# Altium schematic sheet _Geeky_ Sheet1 copy_2023-02-18.schdoc
size 516 x 310 mm; SheetNumber: 1; SheetTotal: 1
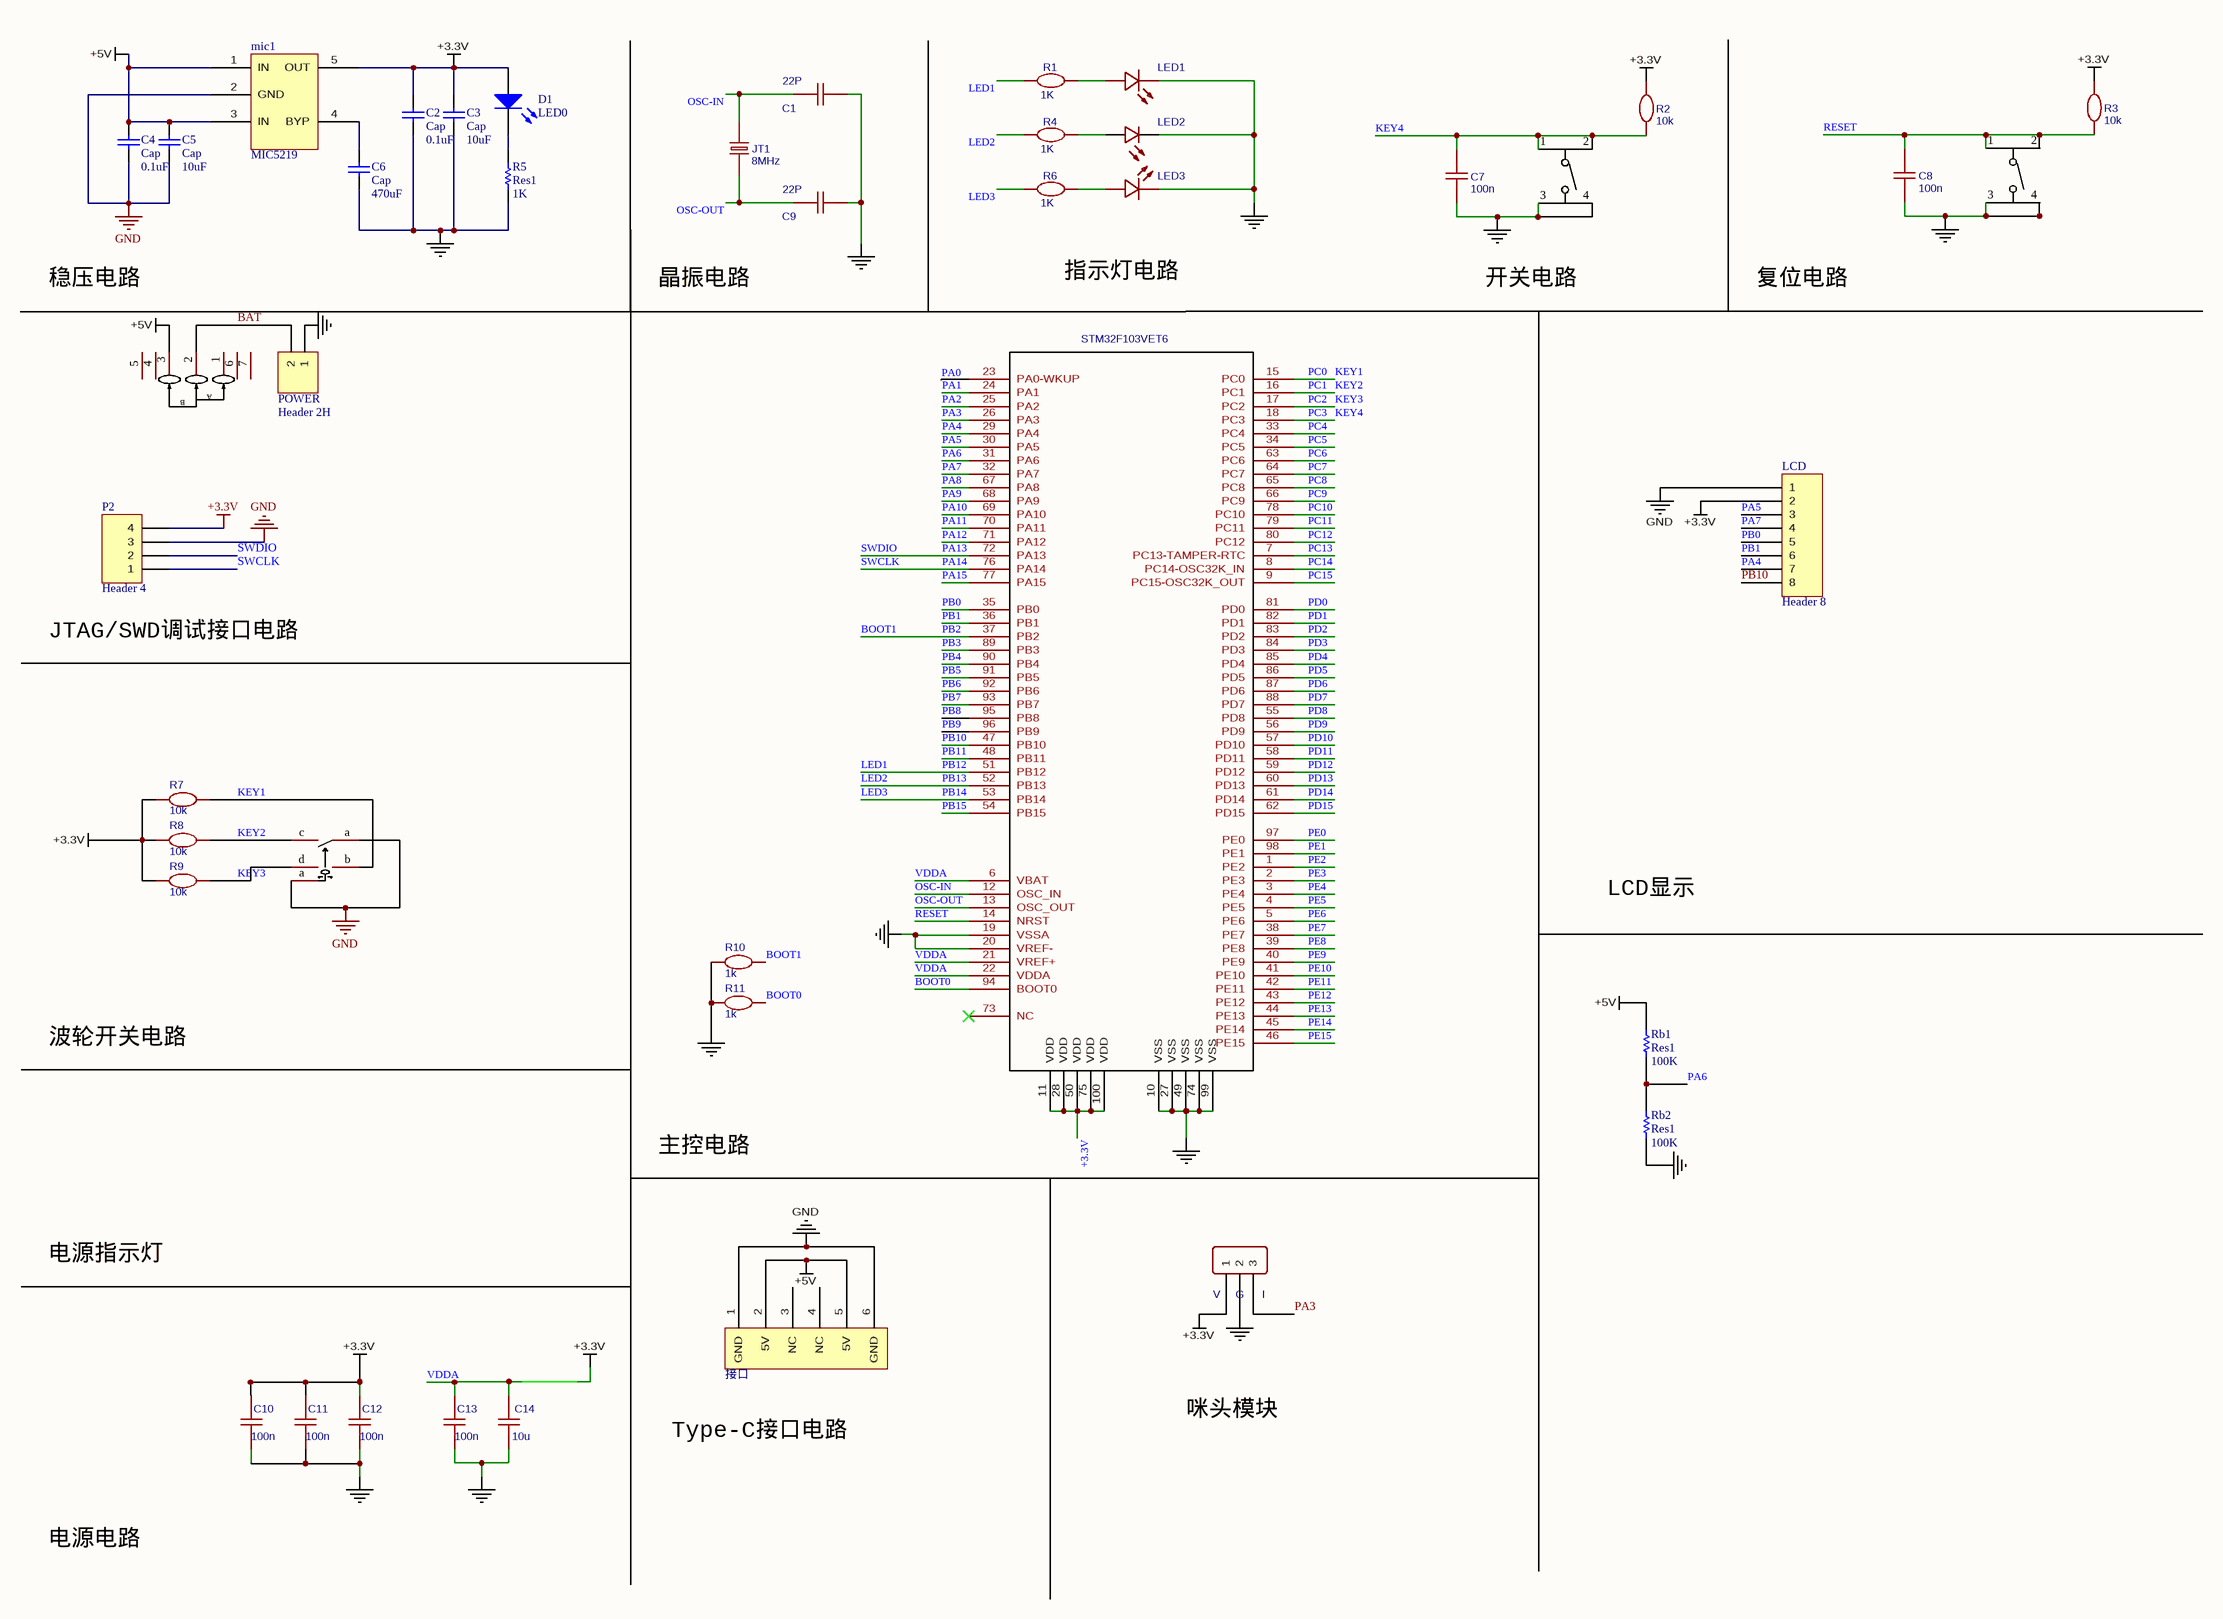
[diagram p0: _Geeky_ Sheet1 copy_2023-02-18.schdoc]

## Parts
?  接口  [typr-c]
C1  22P  [0603]
C2  Cap  value 0.1uF  [0603]
C3  Cap  value 10uF  [0603]
C4  Cap  value 0.1uF  [0603]
C5  Cap  value 10uF  [0603]
C6  Cap  value 470uF  [0603]
C7  100n  [0603]
C8  100n  [0603]
C9  22P  [0603]
C10  100n  [0603]
C11  100n  [0603]
C12  100n  [0603]
C13  100n  [0603]
C14  10u  [0603]
D1  LED0  [led_2]
JT1  8MHz  [OSC-SMD_L5.0-W3.2]
LCD  Header 8  [HDR1X8]
LED1  17-21SUYC/TR8  [led]  (value not drawn)
LED2  17-21/BHC-XL2M2TY/3T  [led]  (value not drawn)
LED3  D-W080508W1-KS2  [led_2]  (value not drawn)
mic1  MIC5219  [mic5219]
P2  Header 4  [HDR1X4]
POWER  Header 2H  [HDR1X2]
R1  1K  [0603]
R2  10k  [0603]
R3  10k  [0603]
R4  1K  [0603]
R5  Res1  value 1K  [0603]
R6  1K  [0603]
R7  10k  [0603]
R8  10k  [0603]
R9  10k  [0603]
R10  1k  [0603]
R11  1k  [0603]
Rb1  Res1  value 100K  [0603]
Rb2  Res1  value 100K  [0603]
SW1  ST-1186BE  [SW-SMD_ST-1186BE]  (value not drawn)
SW2  ST-1186BE  [SW-SMD_ST-1186BE]  (value not drawn)
SW3  TM-2022-3  [旋钮]  (value not drawn)
SW_power  MK-12C02-G025  [sw22]  (value not drawn)
U1  STM32F103VET6  [LQFP-100_L14.0-W14.0-P0.50-LS16.0-BL]
V_G_I  HDR-F-2.54_1x3  [HDR1X3]  (value not drawn)

## Nets
+3.3V: C2.2 C3.2 C10.2 C11.2 C12.2 C13.2 C14.2 D1.1(A) LCD.2 mic1.5(OUT) P2.4 R2.2 R3.2 R7.2 R8.2 R9.2 U1.6(VBAT) U1.11(VDD) U1.21(VREF+) U1.22(VDDA) U1.28(VDD) U1.50(VDD) U1.75(VDD) U1.100(VDD) V_G_I.1  [also labelled VDDA]
+5V: ?.2(5V) ?.5(5V) C4.2 C5.2 mic1.1(IN) mic1.3(IN) Rb1.2 SW_power.3
GND: ?.1(GND) ?.6(GND) C1.1 C2.1 C3.1 C4.1 C5.1 C6.1 C7.2 C8.2 C9.1 C10.1 C11.1 C12.1 C13.1 C14.1 LCD.1 LED1.1(-) LED2.1(-) LED3.2(K) mic1.2(GND) P2.3 POWER.1 R5.1 R10.1 R11.2 Rb2.1 SW1.3 SW1.4 SW2.3 SW2.4 SW3.a U1.10(VSS) U1.19(VSSA) U1.20(VREF-) U1.27(VSS) U1.49(VSS) U1.74(VSS) U1.99(VSS) V_G_I.2
BAT: POWER.2 SW_power.2
BOOT0: R11.1 U1.94(BOOT0)
BOOT1: R10.2 U1.37(PB2)  [also labelled PB2]
KEY1: R7.1 SW3.b U1.15(PC0)  [also labelled PC0]
KEY2: R8.1 SW3.c U1.16(PC1)  [also labelled PC1]
KEY3: R9.1 SW3.d U1.17(PC2)  [also labelled PC2]
KEY4: C7.1 R2.1 SW1.1 SW1.2 U1.18(PC3)  [also labelled PC3]
LED1: R1.1 U1.51(PB12)  [also labelled PB12]
LED2: R4.1 U1.52(PB13)  [also labelled PB13]
LED3: R6.1 U1.53(PB14)  [also labelled PB14]
OSC-IN: C1.2 JT1.2 U1.12(OSC_IN)
OSC-OUT: C9.2 JT1.1 U1.13(OSC_OUT)
PA0: U1.23(PA0-WKUP)
PA1: U1.24(PA1)
PA2: U1.25(PA2)
PA3: U1.26(PA3) V_G_I.3
PA4: LCD.7 U1.29(PA4)
PA5: LCD.3 U1.30(PA5)
PA6: Rb1.1 Rb2.2 U1.31(PA6)
PA7: LCD.4 U1.32(PA7)
PA8: U1.67(PA8)
PA9: U1.68(PA9)
PA10: U1.69(PA10)
PA11: U1.70(PA11)
PA12: U1.71(PA12)
PA13: P2.2 U1.72(PA13)  [also labelled SWDIO]
PA14: P2.1 U1.76(PA14)  [also labelled SWCLK]
PA15: U1.77(PA15)
PB0: LCD.5 U1.35(PB0)
PB1: LCD.6 U1.36(PB1)
PB3: U1.89(PB3)
PB4: U1.90(PB4)
PB5: U1.91(PB5)
PB6: U1.92(PB6)
PB7: U1.93(PB7)
PB8: U1.95(PB8)
PB9: U1.96(PB9)
PB10: LCD.8 U1.47(PB10)
PB11: U1.48(PB11)
PB15: U1.54(PB15)
PC4: U1.33(PC4)
PC5: U1.34(PC5)
PC6: U1.63(PC6)
PC7: U1.64(PC7)
PC8: U1.65(PC8)
PC9: U1.66(PC9)
PC10: U1.78(PC10)
PC11: U1.79(PC11)
PC12: U1.80(PC12)
PC13: U1.7(PC13-TAMPER-RTC)
PC14: U1.8(PC14-OSC32K_IN)
PC15: U1.9(PC15-OSC32K_OUT)
PD0: U1.81(PD0)
PD1: U1.82(PD1)
PD2: U1.83(PD2)
PD3: U1.84(PD3)
PD4: U1.85(PD4)
PD5: U1.86(PD5)
PD6: U1.87(PD6)
PD7: U1.88(PD7)
PD8: U1.55(PD8)
PD9: U1.56(PD9)
PD10: U1.57(PD10)
PD11: U1.58(PD11)
PD12: U1.59(PD12)
PD13: U1.60(PD13)
PD14: U1.61(PD14)
PD15: U1.62(PD15)
PE0: U1.97(PE0)
PE1: U1.98(PE1)
PE2: U1.1(PE2)
PE3: U1.2(PE3)
PE4: U1.3(PE4)
PE5: U1.4(PE5)
PE6: U1.5(PE6)
PE7: U1.38(PE7)
PE8: U1.39(PE8)
PE9: U1.40(PE9)
PE10: U1.41(PE10)
PE11: U1.42(PE11)
PE12: U1.43(PE12)
PE13: U1.44(PE13)
PE14: U1.45(PE14)
PE15: U1.46(PE15)
RESET: C8.1 R3.1 SW2.1 SW2.2 U1.14(NRST)
NetC6_2: C6.2 mic1.4(BYP)
NetD1_2: D1.2(K) R5.2
NetLED1_2: LED1.2(+) R1.2
NetLED2_2: LED2.2(+) R4.2
NetLED3_1: LED3.1(A) R6.2

Not connected (* = marked no-connect by the designer): ? 3(NC) 4(NC); SW_power 1 4 5 6 7; U1 73(NC)*

## Notes on the sheet
- 稳压电路
- 晶振电路
- 指示灯电路
- 开关电路
- 复位电路
- (near P2) JTAG/SWD调试接口电路
- LCD显示
- 波轮开关电路
- 主控电路
- 电源指示灯
- Type-C接口电路
- 咪头模块
- 电源电路
- (in symbol MK-12C02-G025) A; B

## Library data of the parts
? = type-c: TYPE_C
C1 C9 = 20P: nameAlias: Value(F); spicePre: C; spiceSymbolName: Cap_0805_US
C2-C6 = Cap: Capacitor; Published: 8-Jun-2000; LatestRevisionDate: 17-Jul-2002; LatestRevisionNote: Re-released for DXP Platform.; PackageReference: RAD-0.3; Publisher: Altium Limited; PackageDescription: Radial Cap, Thru-Hole; 2 Leads; 0.3 in Pin Spacing
C7 C8 C10-C13 = 100n: nameAlias: Value(F); spicePre: C; spiceSymbolName: Cap_0805_US
C14 = 22u: nameAlias: Value(F); spicePre: C; spiceSymbolName: Cap_0805_US
D1 = LED0: Typical INFRARED GaAs LED; Published: 8-Jun-2000; LatestRevisionDate: 08-Jul-2005; LatestRevisionNote: Mech Layer 1 removed.; PackageReference: LED-0; Publisher: Altium Limited; PackageDescription: LED; 2 Leads
JT1 = 8MHz: BOM_Manufacturer: TAITIEN Elec; BOM_Manufacturer Part: XIHCELNANF-48MHZ; nameAlias: Frequency; Contributor: LCSC; BOM_Supplier: LCSC; BOM_Supplier Part: C295085; spicePre: X; spiceSymbolName: XIHCELNANF-48MHZ
LCD = Header 8: Header, 8-Pin; LatestRevisionDate: 17-Jul-2002; LatestRevisionNote: Re-released for DXP Platform.; Publisher: Altium Limited
LED1 = 17-21SUYC/TR8: BOM_Manufacturer: KENTO; SMT Type: Basic; BOM_Supplier: LCSC; BOM_Manufacturer Part: 17-21SUYC/TR8; BOM_LCSC Assembly: Yes; image: //image.lceda.cn/szlcsc/C2296.jpg; BOM_Supplier Part: C2296; spicePre: L; spiceSymbolName: 17-21SUYC/TR8
LED2 = 17-21/BHC-XL2M2TY/3T: BOM_Manufacturer: EVERLIGHT; SMT Type: Extend; BOM_Supplier: LCSC; BOM_Manufacturer Part: 17-21/BHC-XL2M2TY/3T; image: //image.lceda.cn/szlcsc/C72035.jpg; BOM_Supplier Part: C72035; BOM_LCSC Assembly: Yes; spicePre: L; spiceSymbolName: 17-21/BHC-XL2M2TY/3T
LED3 = D-W080508W1-KS2: BOM_Manufacturer: ARKLED; Contributor: LCSC; BOM_Supplier: LCSC; BOM_Manufacturer Part: D-W080508W1-KS2; BOM_Supplier Part: C130115; spicePre: L; spiceSymbolName: D-W080508W1-KS2
P2 = Header 4: Header, 4-Pin; LatestRevisionDate: 17-Jul-2002; LatestRevisionNote: Re-released for DXP Platform.; Publisher: Altium Limited
POWER = Header 2H: Header, 2-Pin, Right Angle; LatestRevisionDate: 17-Jul-2002; LatestRevisionNote: Re-released for DXP Platform.; Publisher: Altium Limited
R1 R4 R6 = 330: nameAlias: Value(Ω); spicePre: R; spiceSymbolName: Res_0805(1/8W)_EU
R2 R3 R7-R11 = 10k: nameAlias: Value(Ω); spicePre: R; spiceSymbolName: Res_0805(1/8W)_EU
R5 Rb1 Rb2 = Res1: Resistor; Published: 8-Jun-2000; LatestRevisionDate: 17-Jul-2002; LatestRevisionNote: Re-released for DXP Platform.; PackageReference: AXIAL-0.3; Publisher: Altium Limited; PackageDescription: Axial Device, Thru-Hole; 2 Leads; 0.3 in Pin Spacing
SW1 SW2 = ST-1186BE: Manufacturer: RISHENG(日昇); Add into BOM: yes; Contact Current: 50mA; Voltage Rating (DC): 12V; Insulation Resistance: 100MΩ; Circuit: 单刀单掷; Actuator Style: 矩形按钮; Actuator/Cap Color: 黑色; Operating Force: 240gf@±50gf; Mechanical Life: 50000; Pin Style: SMD接片; Switch Length: 3.5mm; Switch Width: 3mm; Switch Height: 1.45mm; Strike Gundam: 否; Name: ST-1186BE; Symbol: ST-1186BE; Device: ST-1186BE; LCSC Part Name: 轻触开关侧按小龟; Supplier Part: C589197; Manufacturer Part: ST-1186BE; Supplier Footprint: SMD; JLCPCB Part Class: Extended Part; Datasheet: https://atta.szlcsc.com/upload/public/pdf/source/20200922/C589197_4714EBBCA4733C94112B39947E772B4E.pdf; Supplier: LCSC; Convert to PCB: yes; Mounting Style: 卧贴; Operating Temperature: -20℃~+85℃
SW3 = TM-2022-3: Manufacturer: XKB Connectivity(中国星坤); Add into BOM: yes; Name: TM-2022-3; Symbol: TM-2022-3; Device: TM-2022-3; LCSC Part Name: 数码相机拨轮开关  3挡拨轮开关; Supplier Part: C318952; Manufacturer Part: TM-2022-3; Supplier Footprint: SMD; JLCPCB Part Class: Extended Part; Datasheet: https://atta.szlcsc.com/upload/public/pdf/source/20211015/3476D939D9FB2BD124C91E3A6F460D4F.pdf; Supplier: LCSC; Convert to PCB: yes
SW_power = MK-12C02-G025: Manufacturer: G-Switch(品赞); Add into BOM: yes; Current Rating (DC): 1A; Voltage Rating (DC): 6V; Circuit: 单刀双掷; Mechanical Life: 10000; Actuator Color: 黑色; Actuator Style: 矩形柱状; Pin Style: SMD接片; Switch Length: 6.6mm; Switch Width: 2.7mm; Switch Height: 5.2mm; Name: MK-12C02-G025; Symbol: MK-12C02-G025; Device: MK-12C02-G025; LCSC Part Name: 七脚小拨动开关2.5柄; Supplier Part: C778186; Manufacturer Part: MK-12C02-G025; Supplier Footprint: SMD; JLCPCB Part Class: Extended Part; Datasheet: https://atta.szlcsc.com/upload/public/pdf/source/20200902/C778186_2AF08473ED98414D93A175E8814EEFA6.pdf; Supplier: LCSC; Convert to PCB: yes; Mounting Style: 卧贴; Operating Temperature: -20℃~+70℃
U1 = STM32F103VET6: BOM_Manufacturer: STMicroelectronics; SMT Type: Basic; BOM_Supplier: LCSC; BOM_Manufacturer Part: STM32F103VET6; BOM_LCSC Assembly: Yes; image: //image.lceda.cn/szlcsc/C8308.jpg; BOM_Supplier Part: C8308; spicePre: U; spiceSymbolName: STM32F103VET6
V_G_I = HDR-F-2.54_1x3: Contributor: LCEDA_Lib; BOM_Supplier Part: C146690; BOM_Supplier: LCSC; spicePre: H; spiceSymbolName: HDR-F-2.54_1x3